# EasyEDA Pro project Flexbus_Cable.eprj

# Schematic Schematic1
Create Date: 2024-02-22; Page Name: P1; Project Name: Flexbus_Cable; Schematic Name: Schematic1; Update Date: 2024-02-22; Company: EasyEDA.com; Drawn: EasyEDA; Page Size: A4; Part Number: JLCPCB-002; Reviewed: EasyEDA; Version: V0.1
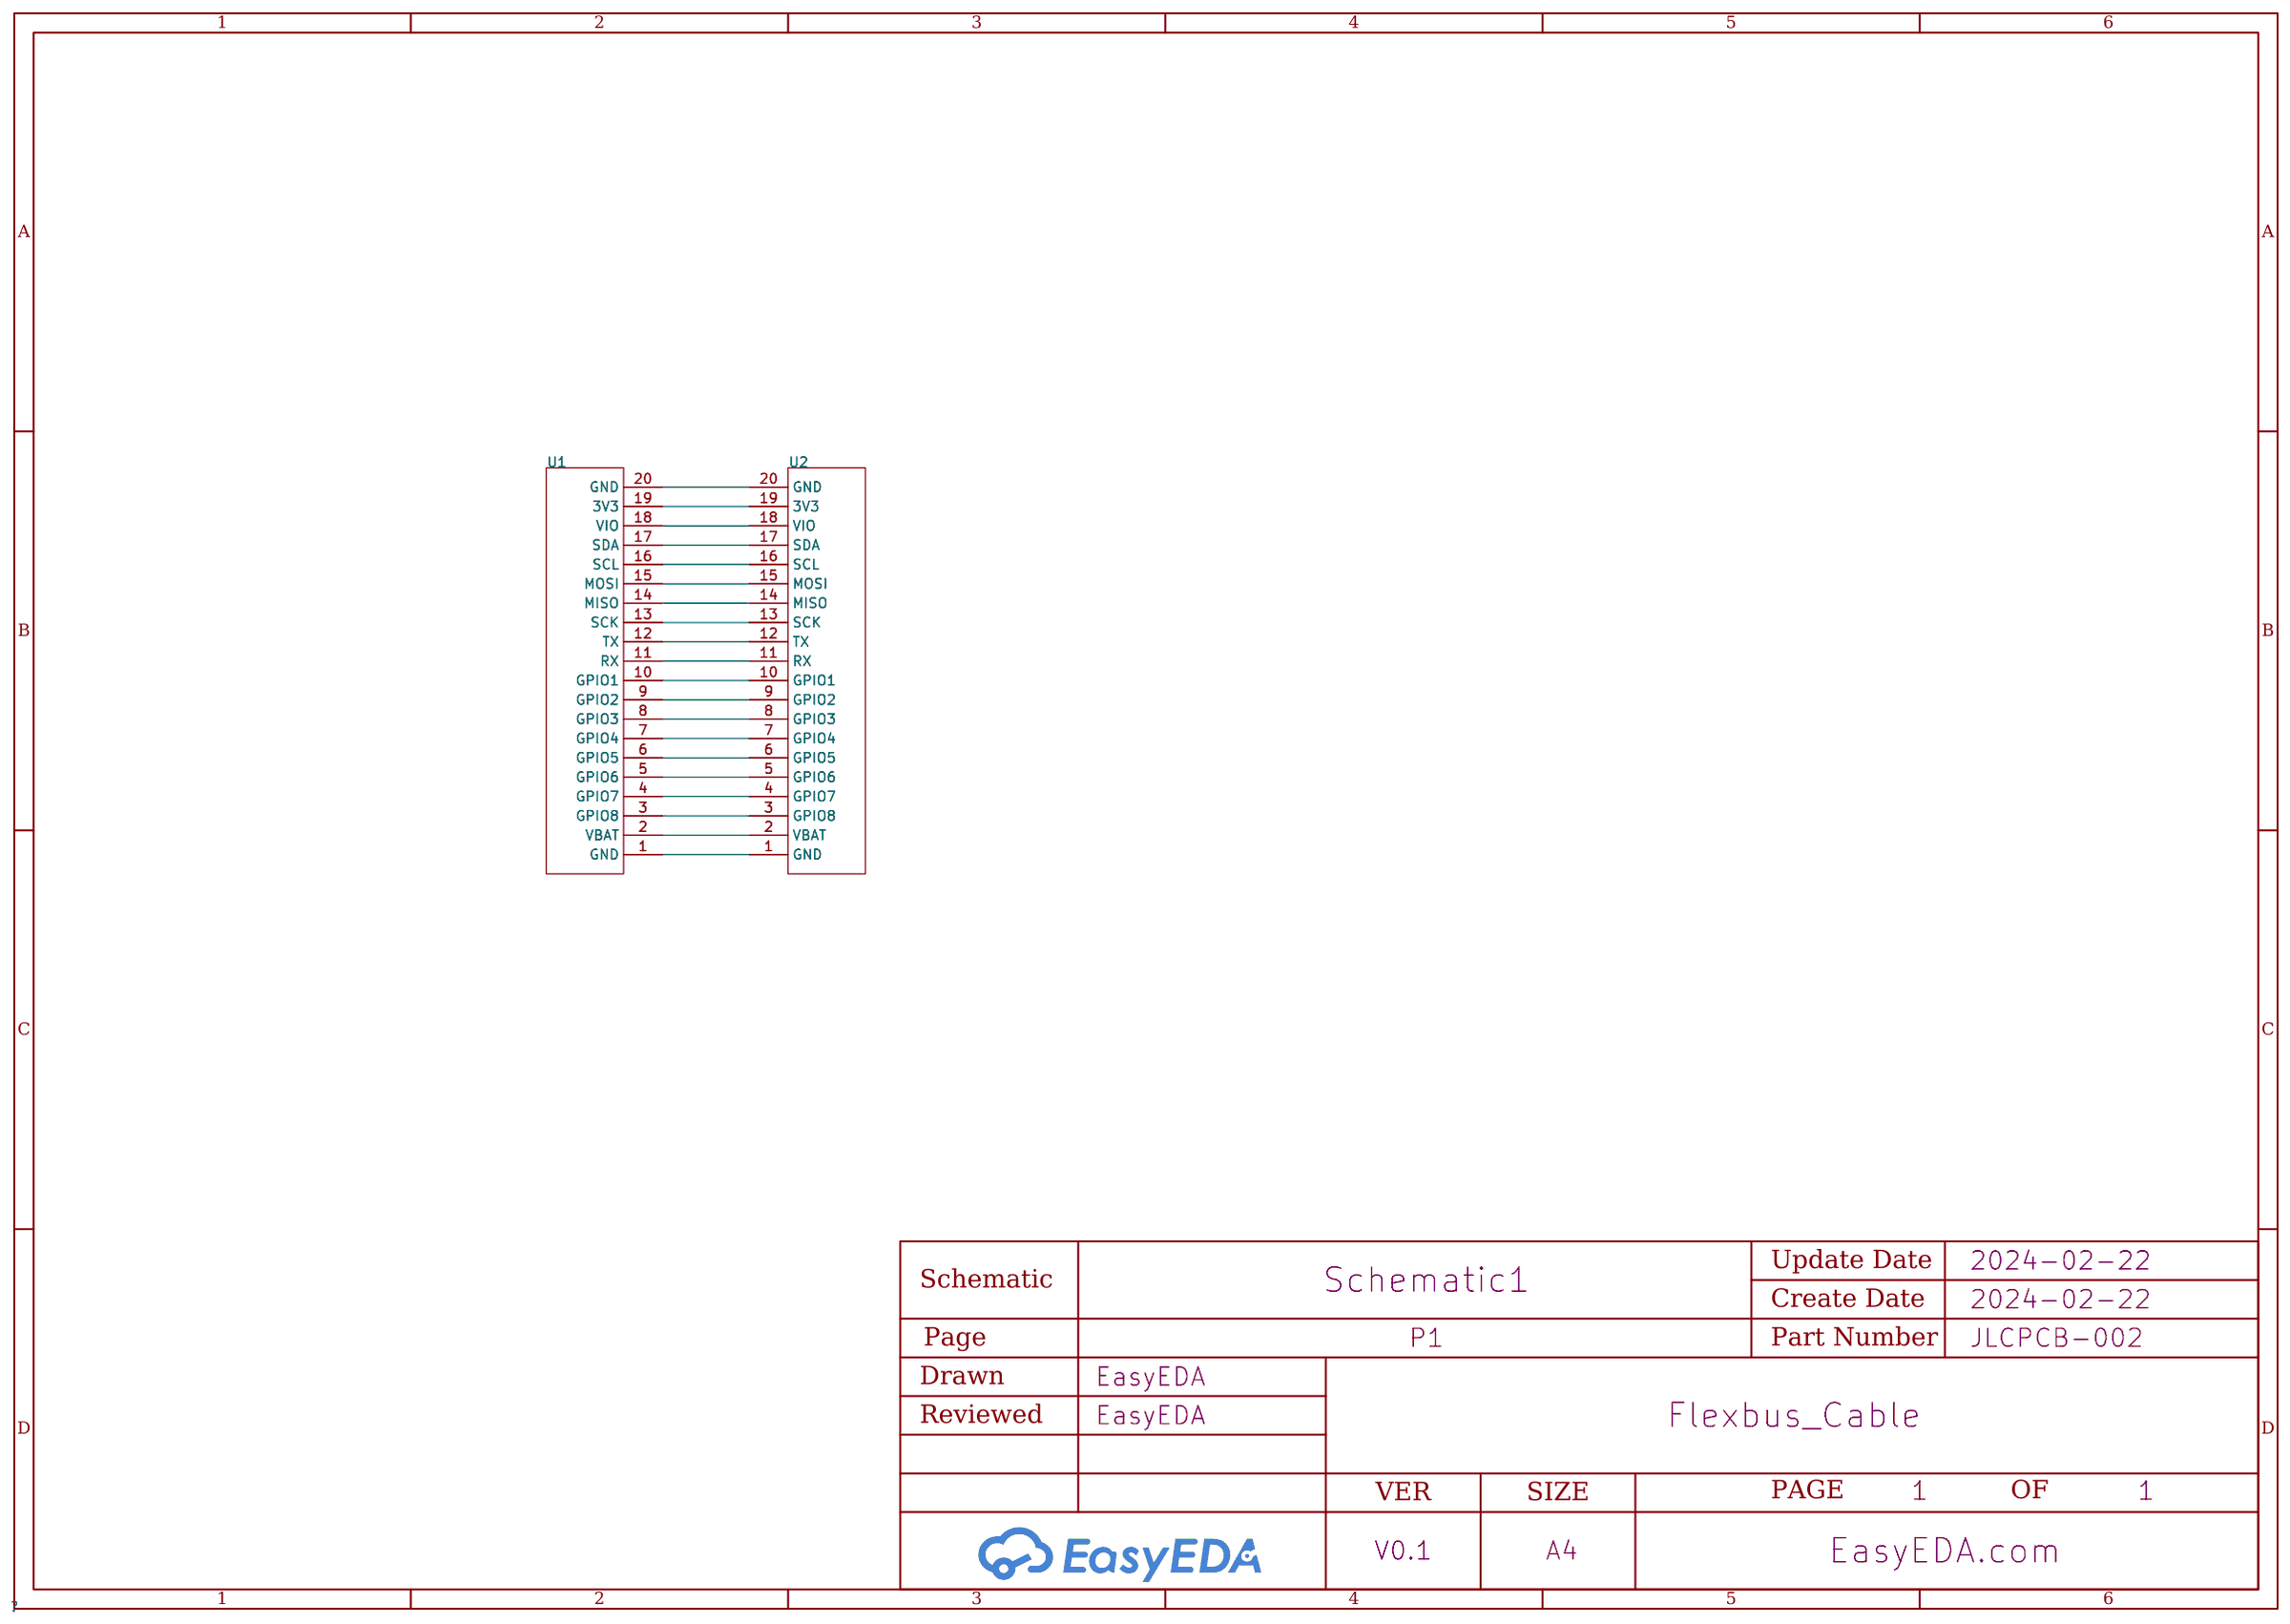
[diagram p0: schematic sheet]

## Parts
U1  -  [FPC 0.5mm 20P]
U2  -  [FPC 0.5mm 20P]

## Library data of the parts
U1 U2 = FlexBus FPC 0.5mm 20P

## Nets
$1N187: U1.1(GND) U2.1(GND)
$1N189: U1.2(VBAT) U2.2(VBAT)
$1N191: U1.3(GPIO8) U2.3(GPIO8)
$1N193: U1.4(GPIO7) U2.4(GPIO7)
$1N195: U1.5(GPIO6) U2.5(GPIO6)
$1N197: U1.6(GPIO5) U2.6(GPIO5)
$1N199: U1.7(GPIO4) U2.7(GPIO4)
$1N201: U1.8(GPIO3) U2.8(GPIO3)
$1N203: U1.9(GPIO2) U2.9(GPIO2)
$1N205: U1.10(GPIO1) U2.10(GPIO1)
$1N207: U1.11(RX) U2.11(RX)
$1N209: U1.12(TX) U2.12(TX)
$1N211: U1.13(SCK) U2.13(SCK)
$1N213: U1.14(MISO) U2.14(MISO)
$1N215: U1.15(MOSI) U2.15(MOSI)
$1N217: U1.16(SCL) U2.16(SCL)
$1N219: U1.17(SDA) U2.17(SDA)
$1N221: U1.18(VIO) U2.18(VIO)
$1N223: U1.19(3V3) U2.19(3V3)
$1N225: U1.20(GND) U2.20(GND)

# Board PCB1
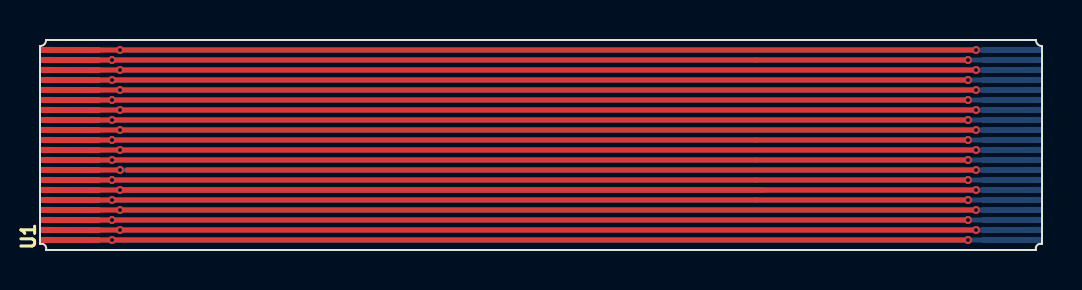
[diagram p1: board, top side]
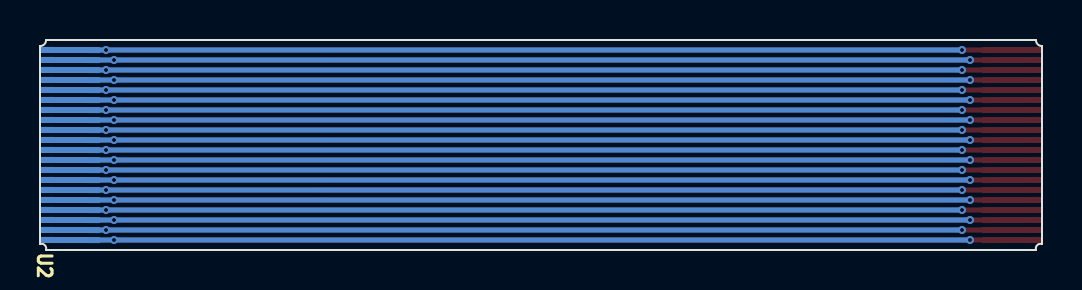
[diagram p2: board, bottom side, seen from below]

Outline 50.1 x 10.5 mm; copper layers: Top Layer, Bottom Layer. Coordinates in mm from the lower left corner of the outline.
Outline path: 3,10.5 47.2,10.5 ; 47.2,0 3,0
Stack: Top Layer 0.012mm / Dielectric1 0.025mm FR4 er 4.5 / Bottom Layer 0.012mm

## Design rules (mm)
template: JLCPCB Capability(Two Layers Board)
spacing copperThickness1oz (default): track to track 0.102, other pairs 0.152 to 0.3
spacing copperThickness2oz: track to track 0.203, other pairs 0.152 to 0.3
track width copperThickness1oz (default): min 0.127, default 0.254, max 2.54
track width copperThickness2oz: min 0.203, default 0.254, max 2.54
differential pair differentialPair (default): width min 0.127, default 0.254, max 2.54; gap min 0.152, default 0.152
via viaSize (default): diameter min 0.5, default 0.61, max 10; hole min 0.3, default 0.305, max 6.3

## Placement (name value [footprint] x y rotation side)
U1  -  [FPC 0.5mm 20P]  3 0 90 top
U2  -  [FPC 0.5mm 20P]  47.1 0 90 bottom

## Footprints (pads in the part's own frame, mm; a bottom-side part is the same pattern mirrored in y, then rotated)
FPC 0.5mm 20P
  custom 0.305x3 smd: 1(0.5,1.5) 2(1,1.5) 3(1.5,1.5) 4(2,1.5) 5(2.5,1.5) 6(3,1.5) 7(3.5,1.5) 8(4,1.5) 9(4.5,1.5) 10(5,1.5) 11(5.5,1.5) 12(6,1.5) 13(6.5,1.5) 14(7,1.5) 15(7.5,1.5) 16(8,1.5) 17(8.5,1.5) 18(9,1.5) 19(9.5,1.5) 20(10,1.5)

## Nets
As in the schematic.

## Via types
v1: diameter 0.4, hole 0.2, Top Layer to Bottom Layer, 40 vias

## Routing (per net, layer and track width the routed paths; a pad name or vN(x,y) marks a point on that pad's centre or on a via; arc(x,y) is an arc through that point)
$1N187: length 89.9
  Top Layer w0.254: v1(46.4,0.5) v1(3.6,0.5) U1.1
  Bottom Layer w0.254: U2.1 v1(46.4,0.5) v1(3.6,0.5)
$1N189: length 89.9
  Top Layer w0.254: v1(46.8,1) v1(4,1) U1.2
  Bottom Layer w0.254: U2.2 v1(46.8,1) v1(4,1)
$1N191: length 89.9
  Top Layer w0.254: v1(46.4,1.5) v1(3.6,1.5) U1.3
  Bottom Layer w0.254: v1(3.6,1.5) v1(46.4,1.5) U2.3
$1N193: length 89.9
  Top Layer w0.254: v1(46.8,2) v1(4,2) U1.4
  Bottom Layer w0.254: U2.4 v1(46.8,2) v1(4,2)
$1N195: length 89.9
  Top Layer w0.254: v1(46.4,2.5) v1(3.6,2.5) U1.5
  Bottom Layer w0.254: v1(3.6,2.5) v1(46.4,2.5) U2.5
$1N197: length 122.1
  Top Layer w0.254: v1(4,3) 36.2,3 ; v1(4,3) v1(46.8,3) ; v1(4,3) U1.6
  Bottom Layer w0.254: U2.6 v1(46.8,3) v1(4,3)
$1N199: length 89.9
  Top Layer w0.254: v1(46.4,3.5) v1(3.6,3.5) U1.7
  Bottom Layer w0.254: U2.7 v1(46.4,3.5) v1(3.6,3.5)
$1N201: length 89.5
  Top Layer w0.254: v1(46.8,4) 4.36,4 ; v1(4,4) U1.8
  Bottom Layer w0.254: v1(4,4) v1(46.8,4) U2.8
$1N203: length 89.9
  Top Layer w0.254: v1(46.4,4.5) v1(3.6,4.5) U1.9
  Bottom Layer w0.254: U2.9 v1(46.4,4.5) v1(3.6,4.5)
$1N205: length 89.9
  Top Layer w0.254: v1(46.8,5) v1(4,5) U1.10
  Bottom Layer w0.254: U2.10 v1(46.8,5) v1(4,5)
$1N207: length 89.9
  Top Layer w0.254: v1(46.4,5.5) v1(3.6,5.5) U1.11
  Bottom Layer w0.254: U2.11 v1(46.4,5.5) v1(3.6,5.5)
$1N209: length 89.9
  Top Layer w0.254: v1(46.8,6) v1(4,6) U1.12
  Bottom Layer w0.254: U2.12 v1(46.8,6) v1(4,6)
$1N211: length 89.9
  Top Layer w0.254: v1(46.4,6.5) v1(3.6,6.5) U1.13
  Bottom Layer w0.254: v1(3.6,6.5) v1(46.4,6.5) U2.13
$1N213: length 89.9
  Top Layer w0.254: v1(46.8,7) v1(4,7) U1.14
  Bottom Layer w0.254: v1(4,7) v1(46.8,7) U2.14
$1N215: length 89.9
  Top Layer w0.254: v1(46.4,7.5) v1(3.6,7.5) U1.15
  Bottom Layer w0.254: v1(3.6,7.5) v1(46.4,7.5) U2.15
$1N217: length 89.9
  Top Layer w0.254: v1(46.8,8) v1(4,8) U1.16
  Bottom Layer w0.254: U2.16 v1(46.8,8) v1(4,8)
$1N219: length 89.9
  Top Layer w0.254: v1(46.4,8.5) v1(3.6,8.5) U1.17
  Bottom Layer w0.254: U2.17 v1(46.4,8.5) v1(3.6,8.5)
$1N221: length 89.9
  Top Layer w0.254: v1(46.8,9) v1(4,9) U1.18
  Bottom Layer w0.254: v1(4,9) v1(46.8,9) U2.18
$1N223: length 89.9
  Top Layer w0.254: v1(46.4,9.5) v1(3.6,9.5) U1.19
  Bottom Layer w0.254: v1(3.6,9.5) v1(46.4,9.5) U2.19
$1N225: length 89.9
  Top Layer w0.254: v1(46.8,10) v1(4,10) U1.20
  Bottom Layer w0.254: U2.20 v1(46.8,10) v1(4,10)

Small or netless copper shapes (teardrops, artwork), in the pictures only: 40 on Top Layer, 80 on Bottom Layer
